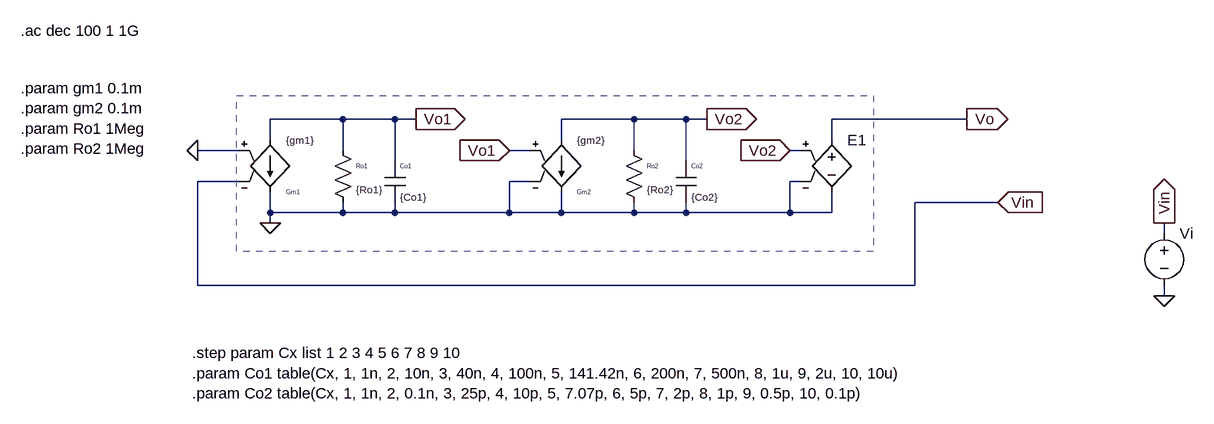
[diagram p0: schematic loopgain.asc]
loopgain.asc, the LTspice schematic file:
Version 4
SHEET 1 2024 800
WIRE 624 160 512 160
WIRE 704 160 624 160
WIRE 736 160 704 160
WIRE 1072 160 960 160
WIRE 1152 160 1072 160
WIRE 1184 160 1152 160
WIRE 1584 160 1376 160
WIRE 512 192 512 160
WIRE 960 192 960 160
WIRE 1376 192 1376 160
WIRE 464 208 400 208
WIRE 624 208 624 160
WIRE 912 208 880 208
WIRE 1072 208 1072 160
WIRE 1328 208 1312 208
WIRE 704 224 704 160
WIRE 1152 224 1152 160
WIRE 464 256 400 256
WIRE 912 256 880 256
WIRE 1328 256 1312 256
WIRE 1632 288 1504 288
WIRE 512 304 512 272
WIRE 624 304 624 288
WIRE 624 304 512 304
WIRE 704 304 704 288
WIRE 704 304 624 304
WIRE 880 304 880 256
WIRE 880 304 704 304
WIRE 960 304 960 272
WIRE 960 304 880 304
WIRE 1072 304 1072 288
WIRE 1072 304 960 304
WIRE 1152 304 1152 288
WIRE 1152 304 1072 304
WIRE 1312 304 1312 256
WIRE 1312 304 1152 304
WIRE 1376 304 1376 272
WIRE 1376 304 1312 304
WIRE 512 320 512 304
WIRE 1888 336 1888 320
WIRE 400 416 400 256
WIRE 1504 416 1504 288
WIRE 1504 416 400 416
WIRE 1888 432 1888 416
FLAG 1888 320 Vin
IOPIN 1888 320 Out
FLAG 1888 432 0
FLAG 512 320 0
FLAG 736 160 Vo1
IOPIN 736 160 Out
FLAG 880 208 Vo1
IOPIN 880 208 In
FLAG 1184 160 Vo2
IOPIN 1184 160 Out
FLAG 1312 208 Vo2
IOPIN 1312 208 In
FLAG 1584 160 Vo
IOPIN 1584 160 Out
FLAG 400 208 0
FLAG 1632 288 Vin
IOPIN 1632 288 In
SYMBOL voltage 1888 320 R0
WINDOW 3 24 38 Invisible 0
SYMATTR Value PULSE(0 1 10u 1n 1n 1000000)
SYMATTR InstName Vi
SYMATTR Value2 AC 1 0
SYMBOL res 608 192 R0
WINDOW 0 36 40 Left 0
WINDOW 3 36 76 Left 1
SYMATTR InstName Ro1
SYMATTR Value {Ro1}
SYMBOL cap 688 224 R0
WINDOW 0 24 8 Left 0
WINDOW 3 24 56 Left 1
SYMATTR InstName Co1
SYMATTR Value {Co1}
SYMBOL res 1056 192 R0
WINDOW 0 36 40 Left 0
WINDOW 3 36 76 Left 1
SYMATTR InstName Ro2
SYMATTR Value {Ro2}
SYMBOL cap 1136 224 R0
WINDOW 0 24 8 Left 0
WINDOW 3 24 56 Left 1
SYMATTR InstName Co2
SYMATTR Value {Co2}
SYMBOL e 1376 176 R0
WINDOW 3 24 38 Invisible 2
SYMATTR Value 1
SYMATTR InstName E1
SYMBOL g2 512 288 M180
WINDOW 0 24 16 Left 0
WINDOW 3 24 96 Left 1
SYMATTR InstName Gm1
SYMATTR Value {gm1}
SYMBOL g2 960 288 M180
WINDOW 0 24 16 Left 0
WINDOW 3 24 96 Left 1
SYMATTR InstName Gm2
SYMATTR Value {gm2}
TEXT 128 24 Left 2 !.ac dec 100 1 1G
TEXT 128 112 Left 2 !.param gm1 0.1m\n.param gm2 0.1m\n.param Ro1 1Meg\n.param Ro2 1Meg
TEXT 392 520 Left 2 !.step param Cx list 1 2 3 4 5 6 7 8 9 10\n.param Co1 table(Cx, 1, 1n, 2, 10n, 3, 40n, 4, 100n, 5, 141.42n, 6, 200n, 7, 500n, 8, 1u, 9, 2u, 10, 10u)\n.param Co2 table(Cx, 1, 1n, 2, 0.1n, 3, 25p, 4, 10p, 5, 7.07p, 6, 5p, 7, 2p, 8, 1p, 9, 0.5p, 10, 0.1p)
RECTANGLE Normal 460 124 1440 364 2

The netlist it stands for:
* loopgain.asc
Vi Vin 0 PULSE(0 1 10u 1n 1n 1000000) AC 1 0
Ro1 Vo1 0 {Ro1}
Co1 Vo1 0 {Co1}
Ro2 Vo2 0 {Ro2}
Co2 Vo2 0 {Co2}
E1 Vo 0 Vo2 0 1
Gm1 Vo1 0 0 Vin {gm1}
Gm2 Vo2 0 Vo1 0 {gm2}
.ac dec 100 1 1G
.param gm1 0.1m
.param gm2 0.1m
.param Ro1 1Meg
.param Ro2 1Meg
.step param Cx list 1 2 3 4 5 6 7 8 9 10
.param Co1 table(Cx, 1, 1n, 2, 10n, 3, 40n, 4, 100n, 5, 141.42n, 6, 200n, 7, 500n, 8, 1u, 9, 2u, 10, 10u)
.param Co2 table(Cx, 1, 1n, 2, 0.1n, 3, 25p, 4, 10p, 5, 7.07p, 6, 5p, 7, 2p, 8, 1p, 9, 0.5p, 10, 0.1p)
.backanno
.end